# Altium schematic sheet Main.SchDoc
size A
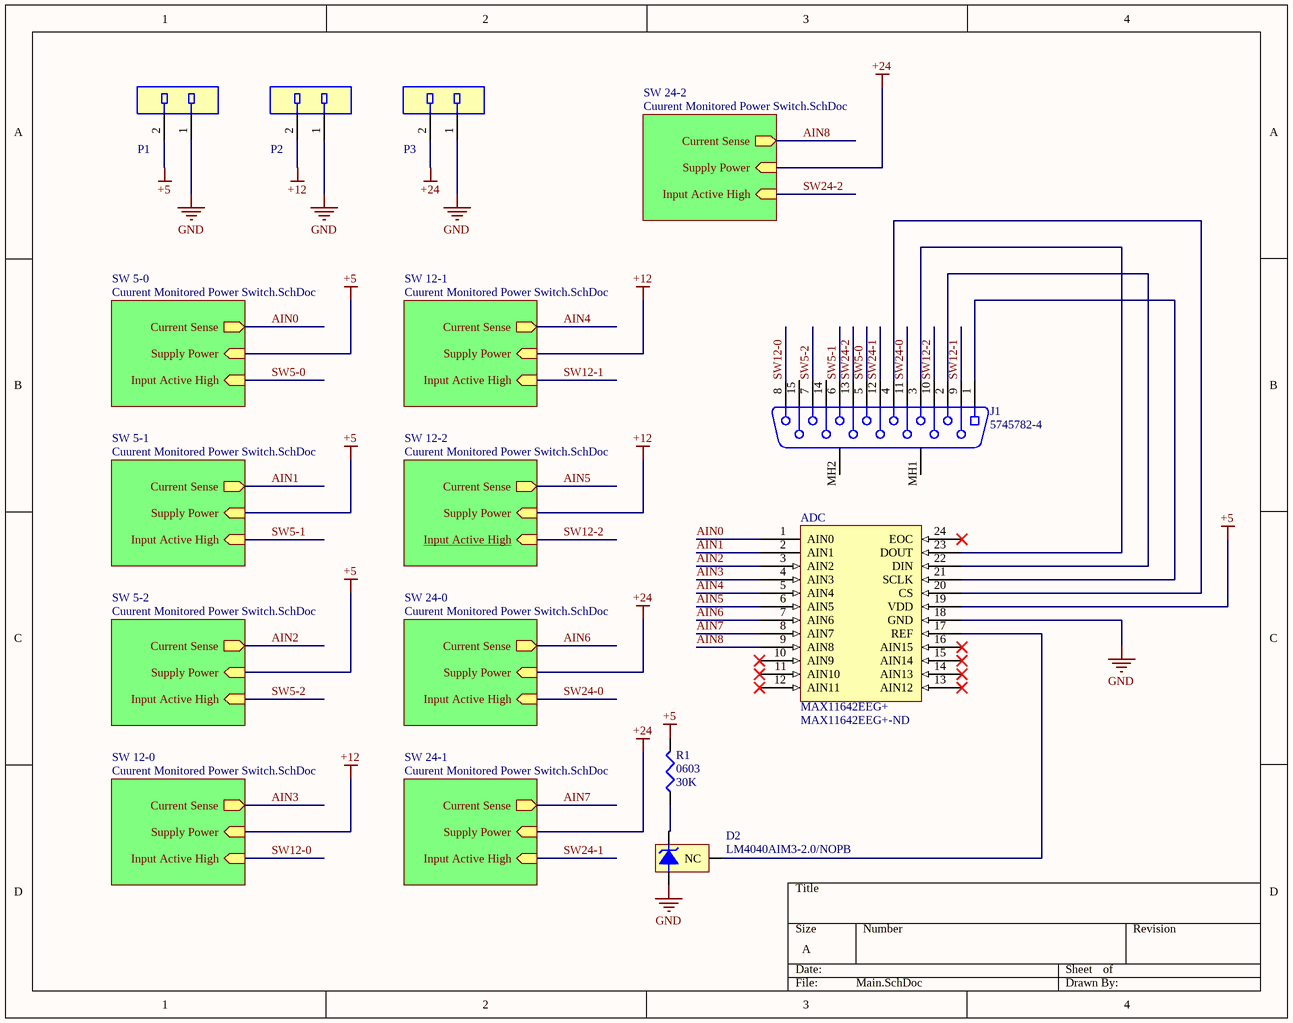
[diagram p0: Main.SchDoc]

## Parts
ADC  MAX11642EEG+  Supplier Part Number 1: MAX11642EEG+-ND  [QSOP-24]
D2  LM4040AIM3-2.0/NOPB  [MF03A_L]
J1  5745782-4  [TECO-5745782-4_V]
P1  70553-0001  [Molex_70553-0001_MFG]  (value not drawn)
P2  70553-0001  [Molex_70553-0001_MFG]  (value not drawn)
P3  70553-0001  [Molex_70553-0001_MFG]  (value not drawn)
R1  0603  value 30K  [J1-0603]

## Sub-sheets
SW 5-0 = Cuurent Monitored Power Switch.SchDoc: Current Sense (out), Supply Power (in), Input Active High (in)
SW 5-1 = Cuurent Monitored Power Switch.SchDoc: Current Sense (out), Supply Power (in), Input Active High (in)
SW 5-2 = Cuurent Monitored Power Switch.SchDoc: Current Sense (out), Supply Power (in), Input Active High (in)
SW 12-0 = Cuurent Monitored Power Switch.SchDoc: Current Sense (out), Supply Power (in), Input Active High (in)
SW 12-1 = Cuurent Monitored Power Switch.SchDoc: Current Sense (out), Supply Power (in), Input Active High (in)
SW 12-2 = Cuurent Monitored Power Switch.SchDoc: Current Sense (out), Supply Power (in), Input Active High (in)
SW 24-0 = Cuurent Monitored Power Switch.SchDoc: Current Sense (out), Supply Power (in), Input Active High (in)
SW 24-1 = Cuurent Monitored Power Switch.SchDoc: Current Sense (out), Supply Power (in), Input Active High (in)
SW 24-2 = Cuurent Monitored Power Switch.SchDoc: Current Sense (out), Supply Power (in), Input Active High (in)

## Nets
+5: ADC.19(VDD) P1.2 R1.2 ; sheet SW 5-0/Supply Power, sheet SW 5-1/Supply Power, sheet SW 5-2/Supply Power
+12: P2.2 ; sheet SW 12-0/Supply Power, sheet SW 12-1/Supply Power, sheet SW 12-2/Supply Power
+24: P3.2 ; sheet SW 24-0/Supply Power, sheet SW 24-1/Supply Power, sheet SW 24-2/Supply Power
GND: ADC.18(GND) D2.2(-V) P1.1 P2.1 P3.1
AIN0: ADC.1(AIN0) ; sheet SW 5-0/Current Sense
AIN1: ADC.2(AIN1) ; sheet SW 5-1/Current Sense
AIN2: ADC.3(AIN2) ; sheet SW 5-2/Current Sense
AIN3: ADC.4(AIN3) ; sheet SW 12-0/Current Sense
AIN4: ADC.5(AIN4) ; sheet SW 12-1/Current Sense
AIN5: ADC.6(AIN5) ; sheet SW 12-2/Current Sense
AIN6: ADC.7(AIN6) ; sheet SW 24-0/Current Sense
AIN7: ADC.8(AIN7) ; sheet SW 24-1/Current Sense
AIN8: ADC.9(AIN8) ; sheet SW 24-2/Current Sense
SW5-0: J1.5 ; sheet SW 5-0/Input Active High
SW5-1: J1.6 ; sheet SW 5-1/Input Active High
SW5-2: J1.7 ; sheet SW 5-2/Input Active High
SW12-0: J1.8 ; sheet SW 12-0/Input Active High
SW12-1: J1.9 ; sheet SW 12-1/Input Active High
SW12-2: J1.10 ; sheet SW 12-2/Input Active High
SW24-0: J1.11 ; sheet SW 24-0/Input Active High
SW24-1: J1.12 ; sheet SW 24-1/Input Active High
SW24-2: J1.13 ; sheet SW 24-2/Input Active High
NetADC_17: ADC.17(REF) D2.3(NC)
NetADC_20: ADC.20(CS) J1.4
NetADC_21: ADC.21(SCLK) J1.1
NetADC_22: ADC.22(DIN) J1.2
NetADC_23: ADC.23(DOUT) J1.3
NetD2_1: D2.1(+V) R1.1

Not connected (* = marked no-connect by the designer): ADC 10(AIN9)* 11(AIN10)* 12(AIN11)* 13(AIN12)* 14(AIN13)* 15(AIN14)* 16(AIN15)* 24(EOC)*; J1 14 15 MH1 MH2

## Library data of the parts
ADC = MAX11642EEG+: ADC Single SAR 300ksps 8-bit Serial 24-Pin QSOP; Manufacturer: Maxim; Sampling Rate: 300000S/s; Resolution: 8b; Number of A/D Converters: 1; Number of Analog Inputs: 16; Polarity: Unipolar; Signal to Noise Ratio (SNR): 49dB; Conversion Rate: 300KS/s; Operating Supply Voltage: 5.25V; Number of Bits: 8; Interface: SPI,Serial; Max Power Dissipation: 762mW; Supplier 1: Digi-Key; Manufacturer Part Number: MAX11642EEG+; RoHS: Yes; Category: Analog to Digital Converters (ADCs); Stock 1: 132; Pricing 1: 1=4.05000, 10=3.64100, 25=3.44200, 100=2.83000, 250=2.53940, 500=2.53200 (USD); Mount: Surface Mount; Case/Package: QSOP; Number of Pins: 24; Min Operating Temperature: -40°C; Max Operating Temperature: 85°C; Supply Type: Single; Number of Converters: 1; Package Quantity: 1; Packaging: Rail/Tube; Radiation Hardening: No; ComponentLink1URL: https://datasheet.ciiva.com/1275/max11638-max11643-1275940.pdf?src-supplier=Digi-Key; ComponentLink1Description: https://datasheet.ciiva.com/1275/max11638-max11643-1275940.pdf?src-supplier=Digi-Key; ComponentLink2URL: https://datasheet.ciiva.com/14260/max11638-max11643-14260779.pdf?src-supplier=Avnet; ComponentLink2Description: https://datasheet.ciiva.com/14260/max11638-max11643-14260779.pdf?src-supplier=Avnet; ComponentLink3URL: https://datasheet.ciiva.com/16611/max11638-max11643-16611753.pdf?src-supplier=Avnet+Europe; ComponentLink3Description: https://datasheet.ciiva.com/16611/max11638-max11643-16611753.pdf?src-supplier=Avnet+Europe
D2 = CMP-0074-00630-2: Precision Micropower Shunt Voltage Reference, 3-pin SOT-23, Pb-Free; Manufacturer: National Semiconductor; Manufacturer Part Number: LM4040EIM7-2.0/NOPB; CompType: Voltage Reference IC; PackageTopMarking: RJA*XTT; PowerWise: N; Output Voltage: 2.048V; Max Output Current: 15mA; Temperature Coefficient: 150ppm/°C; Cathode Current: 70uA; Tolerance: 2%; Number of Channels: 1; ComponentLink2Description: LM4040 Web Page; ComponentLink1URL: http://www.national.com/ds/LM/LM4040.pdf; RevisionNote: Component URLs added; ComponentLink3URL: http://www.national.com/packaging/folders/mf03a.html; PackageReference: MF03A; PackageDescription: Molded SOT-23, .115 x .051 x .037in Body, 3 Lead, .075 in Pitch; ComponentLink2URL: http://www.national.com/pf/LM/LM4040.html; DatasheetVersion: Apr-2005; ComponentLink3Description: MF03A Package Page; PinCount: 3; ComponentLink1Description: LM4040 Datasheet; PackageVersion: revB, Mar-2003; RoHS: Y; Supplier 1: Digi-Key; Category: Voltage References; Stock 1: 2945; Pricing 1: 1=0.44000, 10=0.37500, 25=0.34960, 100=0.25980, 250=0.21980, 500=0.20982 (USD); Mount: Surface Mount; Case/Package: SC; Number of Pins: 5; Min Operating Temperature: -40°C; Max Operating Temperature: 85°C; Output Current: 15mA; Max Output Voltage: 2.048V; Reference Type: Shunt; Packaging: Tape and Reel; Package Quantity: 1000; Radiation Hardening: No; Lead Free: Lead Free; ComponentLink4URL: https://datasheet.ciiva.com/6593/lm4040-n-6593128.pdf?src-supplier=Digi-Key; ComponentLink4Description: https://datasheet.ciiva.com/6593/lm4040-n-6593128.pdf?src-supplier=Digi-Key; ComponentLink5URL: https://datasheet.ciiva.com/26067/lm4040-n-26067450.pdf?src-supplier=Avnet+Europe; ComponentLink5Description: https://datasheet.ciiva.com/26067/lm4040-n-26067450.pdf?src-supplier=Avnet+Europe; ComponentLink6URL: https://datasheet.ciiva.com/14198/lm4040-n-q1-14198445.pdf?src-supplier=Avnet; ComponentLink6Description: https://datasheet.ciiva.com/14198/lm4040-n-q1-14198445.pdf?src-supplier=Avnet
J1 = CMP-2000-05646-1: Female D-Sub Connector, Pitch 2.74 mm, 2 Row, 15 Position, Height 12.93 mm, Tail Length 3.18 mm, -55 to 105 degC, RoHS, Tray; Manufacturer: TE Connectivity; Voltage Rating: 125V; Featured Product: AMPLIMITED-SubminiatureConnectors; Flange Feature: Housing/Shell(4-40); Current Rating: 6A; Number of Positions: 15; Catalog Drawings: AMPD-SubMale.318; Mating Products: 1-745494-8-ND / -CONNPLUG15POS26-22AWGGOLD/FL / A34118-ND / -CONND-SUBPLUG15P22-26AWGAU / A32503-ND / -CONNDSUBPLUG15POSSLDCUP / AMR15B-ND / -CONND-SUBPLUG15POSGOLD / AML15B-ND / -CONND-SUBPLUG15POSGOLD / A31968-ND / -CONND-SUBPLUG15P22-26AWGAU / A31967-ND / -CONND-SUBPLUG15P26-30AWGAU; Connector Type: Receptacle,FemaleSockets; Dynamic Catalog: AMPLIMITEHD-20Series; 3D Model: 5745782-4.pdf; Other Names: A32076; Product Training Modules: AMPLIMITED-SubConnectors; Features: GroundStrap; Termination: Solder; Mounting Type: ThroughHole,RightAngle; Contact Finish Thickness: 30µin(0.76µm); Shell Material, Finish: Steel,TinPlated; Category: Connectors,Interconnects; Shell Size, Connector Layout: 2(DA,A); Package Description: Female D-Sub Connector, Pitch 2.74 mm, 2 Row, 15 Position, Height 12.93 mm, Tail Length 3.18 mm; Color: Black; Family: D-SubConnectors; Series: AMPLIMITEHD-20; Contact Finish: Gold; Mounting Technology: ThroughHole; Housing Material: Thermoplastic; Package Reference: 5745782-4; RoHS Information: 5745782-4StatementofCompliance; Standard Package: 104; Datasheet Version: Rev. R, 08/2011; Manufacturer URL: http://www.te.com/; Number of Rows: 2; Operating Temperature: -55°C~105°C; Connector Style: D-Sub; Datasheet URL: http://www.te.com/commerce/DocumentDelivery/DDEController?Action=srchrtrv&DocNm=5745782&DocType=Customer+Drawing&DocLang=English; Contact Type: Signal
P1-P3 = 70553-0001: Molex Connector 2 pin 90 degree through hole .100
R1 = Res3: Resistor; Published: 8-Jun-2000; LatestRevisionDate: 29-May-2009; LatestRevisionNote: IPC-7351 Footprint Added.; PackageReference: J1-0603; Publisher: Altium Limited; PackageDescription: Chip Resistor